# Altium schematic sheet AFE.SchDoc
size Legal; SheetNumber: 1; SheetTotal: 4
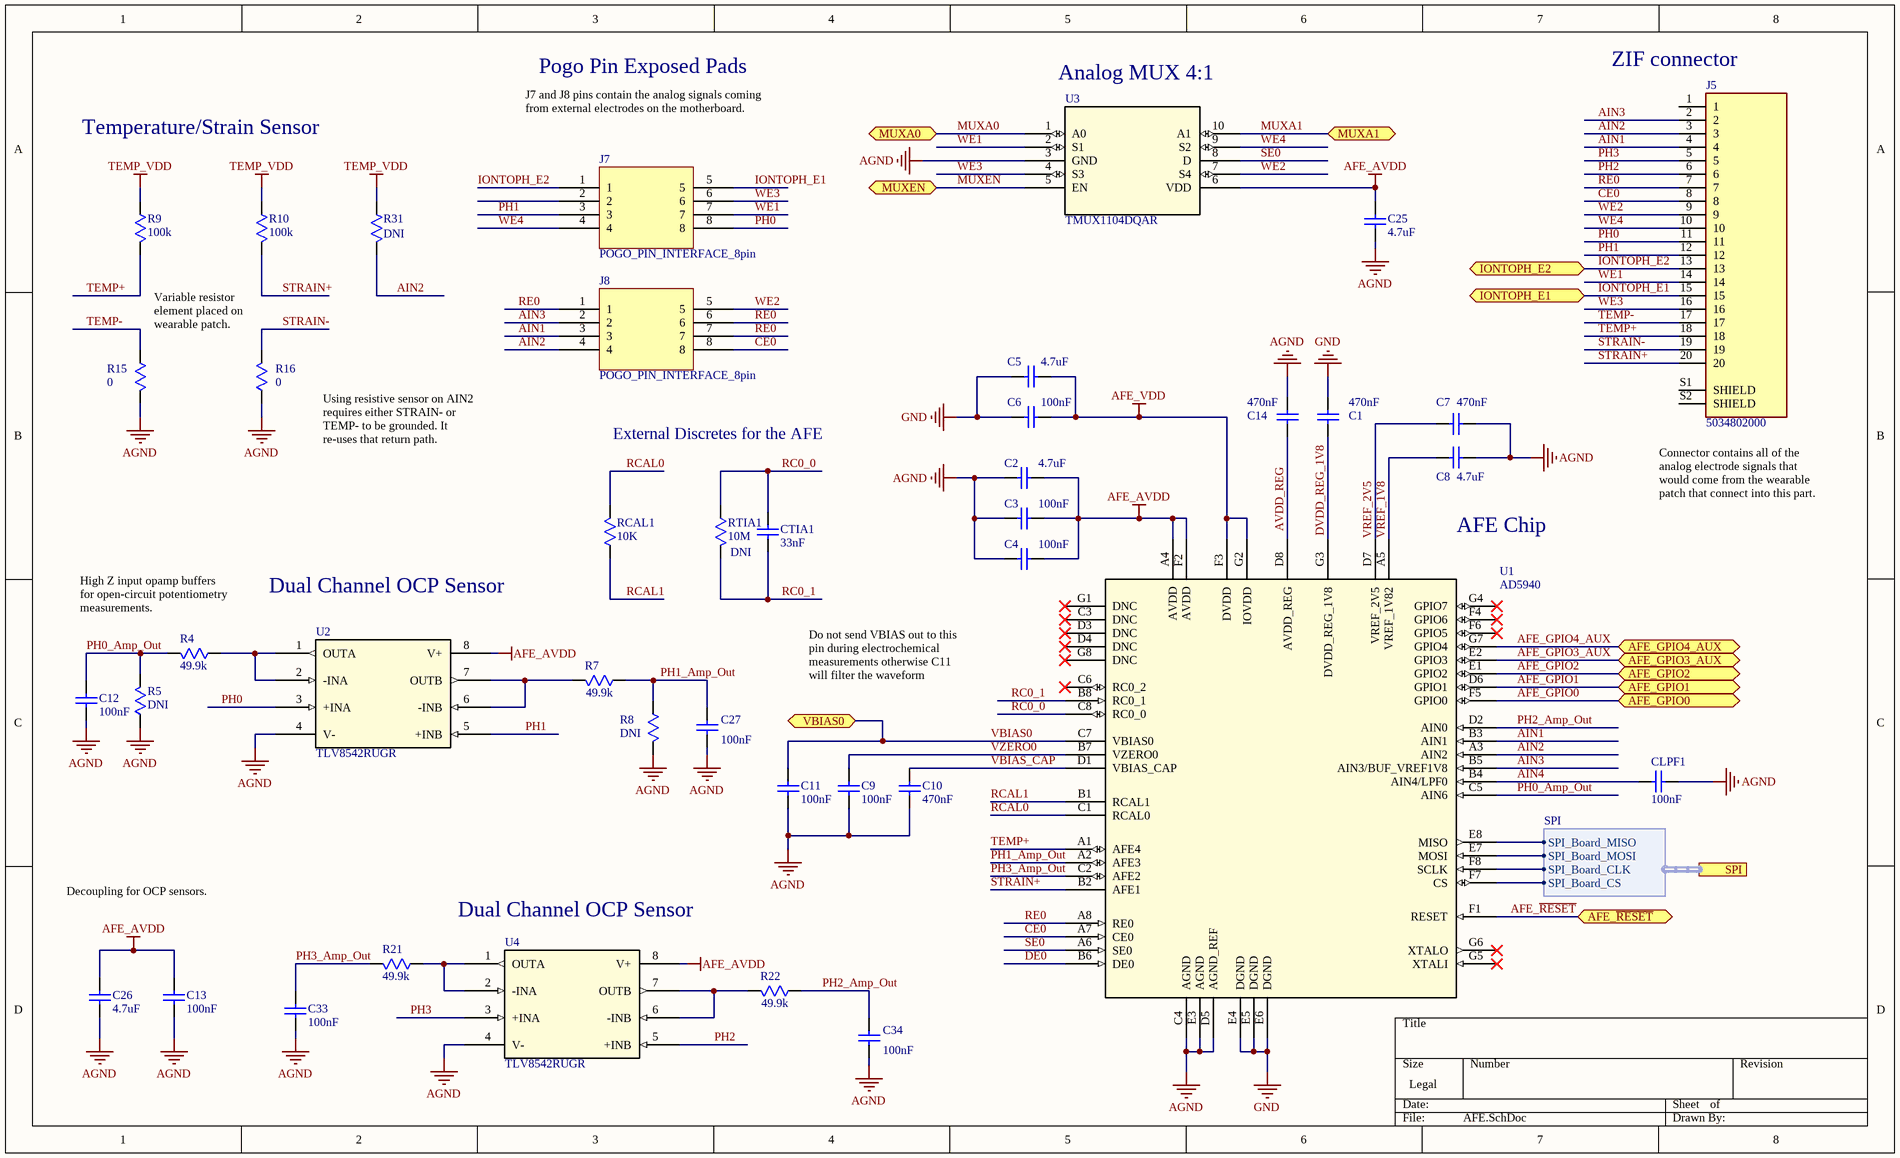
[diagram p0: AFE.SchDoc]

## Parts
C1  value 470nF  [0201 cap]  (hidden comment: CAP)
C2  value 4.7uF  [0201 cap]  (hidden comment: CAP)
C3  value 100nF  [0201 cap]  (hidden comment: CAP)
C4  value 100nF  [0201 cap]  (hidden comment: CAP)
C5  value 4.7uF  [0201 cap]  (hidden comment: CAP)
C6  value 100nF  [0201 cap]  (hidden comment: CAP)
C7  value 470nF  [0201 cap]  (hidden comment: CAP)
C8  value 4.7uF  [0201 cap]  (hidden comment: CAP)
C9  value 100nF  [0402-CAP]  (hidden comment: CAP)
C10  value 470nF  [0201 cap]  (hidden comment: CAP)
C11  value 100nF  [0402-CAP]  (hidden comment: CAP)
C12  value 100nF  [0201 cap]  (hidden comment: CAP)
C13  value 100nF  [0201 cap]  (hidden comment: CAP)
C14  value 470nF  [0201 cap]  (hidden comment: CAP)
C25  value 4.7uF  [0201 cap]  (hidden comment: CAP)
C26  value 4.7uF  [0201 cap]  (hidden comment: CAP)
C27  value 100nF  [0201 cap]  (hidden comment: CAP)
C33  value 100nF  [0201 cap]  (hidden comment: CAP)
C34  value 100nF  [0201 cap]  (hidden comment: CAP)
CLPF1  value 100nF  [0201 cap]  (hidden comment: CAP)
CTIA1  value 33nF  [0402-CAP]  (hidden comment: CAP)
J5  5034802000  [MOLEX_5034802000]
J7  POGO_PIN_INTERFACE_8pin  [POGO_PIN_INTERFACE_8pin]
J8  POGO_PIN_INTERFACE_8pin  [POGO_PIN_INTERFACE_8pin]
R4  value 49.9k  [0201 res]  (hidden comment: RES)
R5  Do Not Install: DNI  [0201 res]  (hidden comment: RES)
R7  value 49.9k  [0201 res]  (hidden comment: RES)
R8  Do Not Install: DNI  [0201 res]  (hidden comment: RES)
R9  value 100k  [0201 res]  (hidden comment: RES)
R10  value 100k  [0201 res]  (hidden comment: RES)
R15  value 0  [0201 res]  (hidden comment: RES)
R16  value 0  [0201 res]  (hidden comment: RES)
R21  value 49.9k  [0201 res]  (hidden comment: RES)
R22  value 49.9k  [0201 res]  (hidden comment: RES)
R31  Do Not Install: DNI  [0201 res]  (hidden comment: RES)
RCAL1  value 10K  [0201 res]  (hidden comment: RES)
RTIA1  value 10M  Do Not Install: DNI  [0402-RES]  (hidden comment: RES)
U1  AD5940  [CB-56-3_ADI]
U2  TLV8542RUGR  [QFN50P150X150X40-8N]
U3  TMUX1104DQAR  [USON_104DQAR_TEX]
U4  TLV8542RUGR  [QFN50P150X150X40-8N]

## Ports
AFE_GPIO0 (bidir), AFE_GPIO1 (bidir), AFE_GPIO2 (bidir), AFE_GPIO3_AUX (bidir), AFE_GPIO4_AUX (bidir), AFE_~{RESET} (bidir), IONTOPH_E1 (bidir), IONTOPH_E2 (bidir), MUXA0 (bidir), MUXA1 (bidir), MUXEN (bidir), SPI (harness SPI), VBIAS0 (bidir)

## Harnesses
SPI: SPI_Board_MISO, SPI_Board_MOSI, SPI_Board_CLK, SPI_Board_CS

## Nets
AFE_AVDD: C2.1 C3.1 C4.1 C13.2 C25.2 C26.2 U1.A4(AVDD) U1.F2(AVDD) U2.8(V+) U3.6(VDD) U4.8(V+)
AFE_VDD: C5.1 C6.1 U1.F3(DVDD) U1.G2(IOVDD)
AGND: C2.2 C3.2 C4.2 C7.1 C8.1 C9.1 C10.1 C11.1 C12.2 C13.1 C14.1 C25.1 C26.1 C27.2 C33.2 C34.2 CLPF1.2 R5.2 R8.2 R15.2 R16.2 U1.C4(AGND) U1.D5(AGND_REF) U1.E3(AGND) U2.4(V-) U3.3(GND) U4.4(V-)
GND: C1.1 C5.2 C6.2 U1.E4(DGND) U1.E5(DGND) U1.E6(DGND)
TEMP_VDD: R9.1 R10.1 R31.1
AFE_GPIO0: U1.F5(GPIO0) ; port AFE_GPIO0
AFE_GPIO1: U1.D6(GPIO1) ; port AFE_GPIO1
AFE_GPIO2: U1.E1(GPIO2) ; port AFE_GPIO2
AFE_GPIO3_AUX: U1.E2(GPIO3) ; port AFE_GPIO3_AUX
AFE_GPIO4_AUX: U1.G7(GPIO4) ; port AFE_GPIO4_AUX
AFE_~{RESET}: U1.F1(RESET) ; port AFE_~{RESET}
AIN1: J5.4 J8.3 U1.B3(AIN1)
AIN2: J5.3 J8.4 R31.2 U1.A3(AIN2)
AIN3: J5.2 J8.2 U1.B5(AIN3/BUF_VREF1V8)
AIN4: CLPF1.1 U1.B4(AIN4/LPF0)
AVDD_REG: C14.2 U1.D8(AVDD_REG)
CE0: J5.8 J8.8 U1.A7(CE0)
DE0: U1.B6(DE0)
DVDD_REG_1V8: C1.2 U1.G3(DVDD_REG_1V8)
IONTOPH_E1: J5.15 J7.5 ; port IONTOPH_E1
IONTOPH_E2: J5.13 J7.1 ; port IONTOPH_E2
MUXA0: U3.1(A0) ; port MUXA0
MUXA1: U3.10(A1) ; port MUXA1
MUXEN: U3.5(EN) ; port MUXEN
PH0: J5.11 J7.8 U2.3(+INA)
PH0_Amp_Out: C12.1 R4.1 R5.1 U1.C5(AIN6)
PH1: J5.12 J7.3 U2.5(+INB)
PH1_Amp_Out: C27.1 R7.1 R8.1 U1.A2(AFE3)
PH2: J5.6 U4.5(+INB)
PH2_Amp_Out: C34.1 R22.1 U1.D2(AIN0)
PH3: J5.5 U4.3(+INA)
PH3_Amp_Out: C33.1 R21.1 U1.C2(AFE2)
RC0_0: CTIA1.1 RTIA1.1 U1.C8(RC0_0)
RC0_1: CTIA1.2 RTIA1.2 U1.B8(RC0_1)
RCAL0: RCAL1.2 U1.C1(RCAL0)
RCAL1: RCAL1.1 U1.B1(RCAL1)
RE0: J5.7 J8.1 J8.6 J8.7 U1.A8(RE0)
SE0: U1.A6(SE0) U3.8(D)
STRAIN+: J5.20 R10.2 U1.B2(AFE1)
STRAIN-: J5.19 R16.1
TEMP+: J5.18 R9.2 U1.A1(AFE4)
TEMP-: J5.17 R15.1
VBIAS0: C11.2 U1.C7(VBIAS0) ; port VBIAS0
VBIAS_CAP: C10.2 U1.D1(VBIAS_CAP)
VREF_1V8: C8.2 U1.A5(VREF_1V82)
VREF_2V5: C7.2 U1.D7(VREF_2V5)
VZERO0: C9.2 U1.B7(VZERO0)
WE1: J5.14 J7.7 U3.2(S1)
WE2: J5.9 J8.5 U3.7(S4)
WE3: J5.16 J7.6 U3.4(S3)
WE4: J5.10 J7.4 U3.9(S2)
NetR4_2: R4.2 U2.1(OUTA) U2.2(-INA)
NetR7_2: R7.2 U2.6(-INB) U2.7(OUTB)
NetR21_2: R21.2 U4.1(OUTA) U4.2(-INA)
NetR22_2: R22.2 U4.6(-INB) U4.7(OUTB)
NetU1_E7: U1.E7(MOSI) ; port SPI.SPI_Board_MOSI
NetU1_E8: U1.E8(MISO) ; port SPI.SPI_Board_MISO
NetU1_F7: U1.F7(CS) ; port SPI.SPI_Board_CS
NetU1_F8: U1.F8(SCLK) ; port SPI.SPI_Board_CLK

Not connected (* = marked no-connect by the designer): J5 1 S1(SHIELD) S2(SHIELD); J7 2; U1 C3(DNC)* C6(RC0_2)* D3(DNC)* D4(DNC)* F4(GPIO6)* F6(GPIO5)* G1(DNC)* G4(GPIO7)* G5(XTALI)* G6(XTALO)* G8(DNC)*

## Notes on the sheet
- Pogo Pin Exposed Pads
- (near U3) Analog MUX 4:1
- (near J5) ZIF connector
- Temperature/Strain Sensor
- J7 and J8 pins contain the analog signals coming from external electrodes on the motherboard.
- Variable resistor element placed on wearable patch.
- Using resistive sensor on AIN2 requires either STRAIN- or TEMP- to be grounded. It re-uses that return path.
- External Discretes for the AFE
- (near J5) Connector contains all of the analog electrode signals that would come from the wearable patch that connect into this part.
- AFE Chip
- (near R4) High Z input opamp buffers for open-circuit potentiometry measurements.
- Dual Channel OCP Sensor
- Do not send VBIAS out to this pin during electrochemical measurements otherwise C11 will filter the waveform
- Decoupling for OCP sensors.

## Library data of the parts
C1-C14 C25-C27 C33 C34 CLPF1 CTIA1 = CAP SMD: Multilayer Chip Capacitor; Designer: OMIGA
J5 = 5034802000: 20 Position FFC, FPC Connector Contacts, Top and Bottom 0.020 (0.50mm) Surface Mount, Right Angle; MP: 503480-2000; MF: Molex; Check_prices: https://www.snapeda.com/parts/503480-2000/Molex/view-part/?ref=eda; Value: *; Availability: In Stock; Price: None; Package: None; SnapEDA_Link: https://www.snapeda.com/parts/503480-2000/Molex/view-part/?ref=snap; Purchase-URL: https://pricing.snapeda.com/search/part/503480-2000/?ref=eda
R4 R5 R7-R10 R15 R16 R21 R22 RTIA1 = RES SMD: Surface Mount Resistor; Designer: OMIGA
R31 = RES SMD: Surface Mount Resistor; Designer: OMIGA; Value: 100k
RCAL1 = RES 0201: Surface Mount Resistor; Designer: OMIGA
U1 = AD5940: High Precision, Impedance, and / Electrochemical Front End
U2 U4 = TLV8542RUGR: Low power, tiny, low input bias current opamp; Mfr_Name: Texas Instruments; RefDes: RefDes; Type: Type
U3 = TMUX1104DQAR_1: No Description Available; Mfr_Name: Texas Instruments; Copyright: Copyright (C) 2022 Ultra Librarian. All rights reserved.; Manufacturer_Part_Number: TMUX1104DQAR; Digi-Key_Part_Number_1: 296-TMUX1104DQARTR-ND; Digi-Key_Part_Number_2: 296-TMUX1104DQARCT-ND; Digi-Key_Part_Number_3: 296-TMUX1104DQARDKR-ND; RefDes: RefDes; Type: DEV